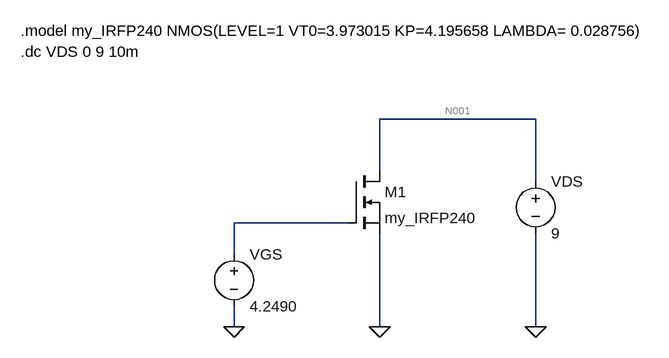
[diagram p0: schematic my_mos.asc]
my_mos.asc, the LTspice schematic file:
Version 4
SHEET 1 1028 680
WIRE 768 160 528 160
WIRE 528 240 528 160
WIRE 768 256 768 160
WIRE 480 320 304 320
WIRE 304 368 304 320
WIRE 304 480 304 448
WIRE 528 480 528 336
WIRE 768 480 768 336
FLAG 304 480 0
FLAG 528 480 0
FLAG 768 480 0
SYMBOL nmos 480 240 R0
SYMATTR InstName M1
SYMATTR Value my_IRFP240
SYMBOL voltage 304 352 R0
WINDOW 123 0 0 Left 0
WINDOW 39 0 0 Left 0
SYMATTR InstName VGS
SYMATTR Value 4.2490
SYMBOL voltage 768 240 R0
WINDOW 123 0 0 Left 0
WINDOW 39 0 0 Left 0
SYMATTR InstName VDS
SYMATTR Value 9
TEXT -24 24 Left 2 !.model my_IRFP240 NMOS(LEVEL=1 VT0=3.973015 KP=4.195658 LAMBDA= 0.028756)
TEXT -24 56 Left 2 !.dc VDS 0 9 10m

The netlist it stands for:
* my_mos.asc
M1 N001 N002 0 0 my_IRFP240
VGS N002 0 4.2490
VDS N001 0 9
.model NMOS NMOS
.model PMOS PMOS
.lib standard.mos
.model my_IRFP240 NMOS(LEVEL=1 VT0=3.973015 KP=4.195658 LAMBDA= 0.028756)
.dc VDS 0 9 10m
.backanno
.end

* Results of the author's LTspice run, read from the files saved beside the schematic
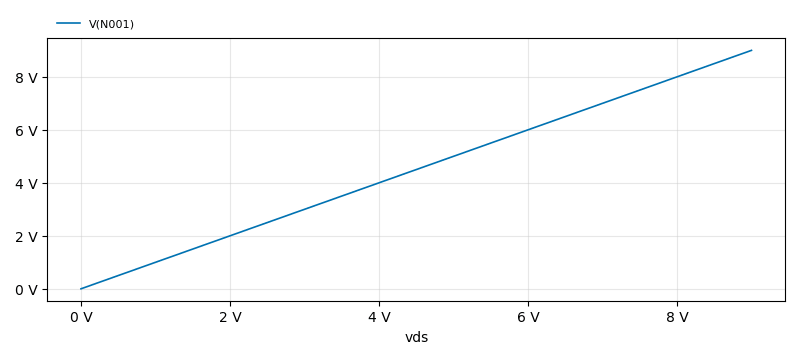
[diagram p1: DC transfer characteristic of my_mos.asc, plotted from the saved traces]
* DC transfer characteristic, 1 run:
*   V(N001): 0 V at vds=0 V, 9 V at vds=9 V, min 0 V, max 9 V